# Altium schematic sheet ADCs.SchDoc
size A4
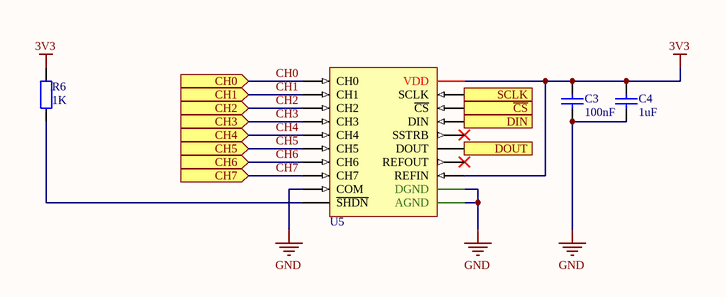
[diagram p0: ADCs.SchDoc]

## Parts
C3  100nF  [FP_0805_CAP_085]
C4  1uF  [FP_0805_CAP_085]
R6  1K  [FP_0805_RES]
U5  MAX1110CAP+  [20-Pin SSOP]  (value not drawn)

## Ports
CH0 (in), CH1 (in), CH2 (in), CH3 (in), CH4 (in), CH5 (in), CH6 (in), CH7 (in), DIN (in), DOUT (out), SCLK (in), ~{CS} (in)

## Nets
3V3: C3.2 C4.2 R6.2 U5.11(REFIN) U5.20(VDD)
GND: C3.1 C4.1 U5.9(COM) U5.13(AGND) U5.14(DGND)
~{CS}: U5.18(~{CS}) ; port ~{CS}
CH0: U5.1(CH0) ; port CH0
CH1: U5.2(CH1) ; port CH1
CH2: U5.3(CH2) ; port CH2
CH3: U5.4(CH3) ; port CH3
CH4: U5.5(CH4) ; port CH4
CH5: U5.6(CH5) ; port CH5
CH6: U5.7(CH6) ; port CH6
CH7: U5.8(CH7) ; port CH7
DIN: U5.17(DIN) ; port DIN
DOUT: U5.15(DOUT) ; port DOUT
SCLK: U5.19(SCLK) ; port SCLK
NetR6_1: R6.1 U5.10(~{SHDN})

Not connected (* = marked no-connect by the designer): U5 12(REFOUT)* 16(SSTRB)*

## Library data of the parts
C3 = CAP 100nF: Capacitor; Tolerance: +80%/-20%; Voltage: 25V; Reference: 1759167; Name: SMD Multilayer Ceramic Capacitor, 0805; Supplier: Farnell; Value: 100nF
C4 = CAP 1uF: Capacitor; Tolerance: +80%/-20%; Voltage: 25V; Reference: 1828853; Name: SMD Multilayer Ceramic Capacitor, 0805; Supplier: Farnell; Value: 1uF
R6 = RES 1K: Resistor; Tolerance: 5%; Power: 125mW; Name: YAGEO (PHYCOMP)  RC0805JR-071KL  SMD Chip Resistor, Thick Film, 1 kohm; Reference: 9234004; Supplier: Farnell; Value: 1K
U5 = MAX1110CAP+: Analogue to Digital Converter, Low Power, 8 bit, 50 kSPS, Single, 2.7 V, 5.5 V, SSOP